# Altium schematic sheet ADC.SchDoc
size A; SheetNumber: 1; SheetTotal: 1
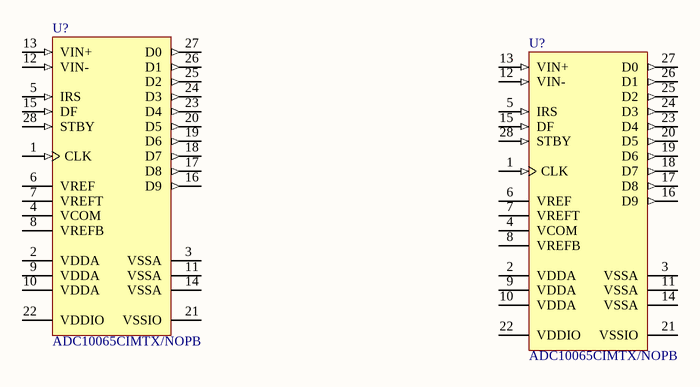
[diagram p0: ADC.SchDoc]

## Parts
(Parts that share a designator on the sheet are numbered #1, #2 ... from top to bottom, then left to right.)
U?#1  ADC10065CIMTX/NOPB  [PW0028A_N]
U?#2  ADC10065CIMTX/NOPB  [PW0028A_N]

## Nets

Not connected (* = marked no-connect by the designer): U?#1 1(CLK) 2(VDDA) 3(VSSA) 4(VCOM) 5(IRS) 6(VREF) 7(VREFT) 8(VREFB) 9(VDDA) 10(VDDA) 11(VSSA) 12(VIN-) 13(VIN+) 14(VSSA) 15(DF) 16(D9) 17(D8) 18(D7) 19(D6) 20(D5) 21(VSSIO) 22(VDDIO) 23(D4) 24(D3) 25(D2) 26(D1) 27(D0) 28(STBY); U?#2 1(CLK) 2(VDDA) 3(VSSA) 4(VCOM) 5(IRS) 6(VREF) 7(VREFT) 8(VREFB) 9(VDDA) 10(VDDA) 11(VSSA) 12(VIN-) 13(VIN+) 14(VSSA) 15(DF) 16(D9) 17(D8) 18(D7) 19(D6) 20(D5) 21(VSSIO) 22(VDDIO) 23(D4) 24(D3) 25(D2) 26(D1) 27(D0) 28(STBY)

## Library data of the parts
U?#1 U?#2 = CMP-0054-00386-3: 10-Bit 65 MSPS 3V A/D Converter, 28-pin TSSOP, Pb-Free; Manufacturer: Texas Instruments; CompType: ADC IC; PowerWise: N; PackageTopMarking: NSUZXYTTE#*ADC10065*CIMT; PinCount: 28; RoHS: Y; PackageReference: PW0028A; ComponentLink1Description: Datasheet URL; Code_JEDEC: MO-153-AE; PackageDescription: Molded TSSOP, Jedec, 9.7 x 4.4 x 0.9mm Body, 28 Lead, 0.65mm Pitch; ComponentLink1URL: http://www.ti.com/general/docs/lit/getliterature.tsp?genericPartNumber=ADC10065&fileType=pdf